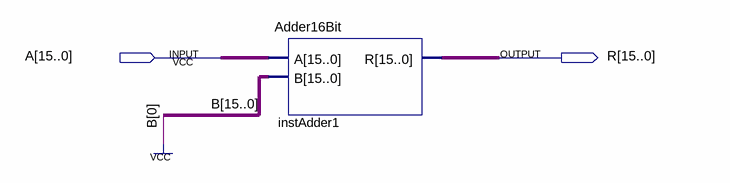
[diagram p0: schematic sheet]
// Quartus schematic INC16Bit.bdf as structural Verilog: 1 symbols, 2 pins
module INC16Bit (
  input  [15:0] A,
  output [15:0] R
);

  wire [15:1] B;

  Adder16Bit instAdder1 (.A(A), .B({B, 1'b1}), .R(R));
endmodule
